# EasyEDA schematic KegWasher_12V_Abort_Filter_1.1_Schematic.EasyEDA.json
TITLE: Keg Washer 12V Abort Filter; REV: 1.1; Date: 2020-05-13; Sheet: 1/1; Drawn By: Kyle Hultman; Company: Kyle Hultman
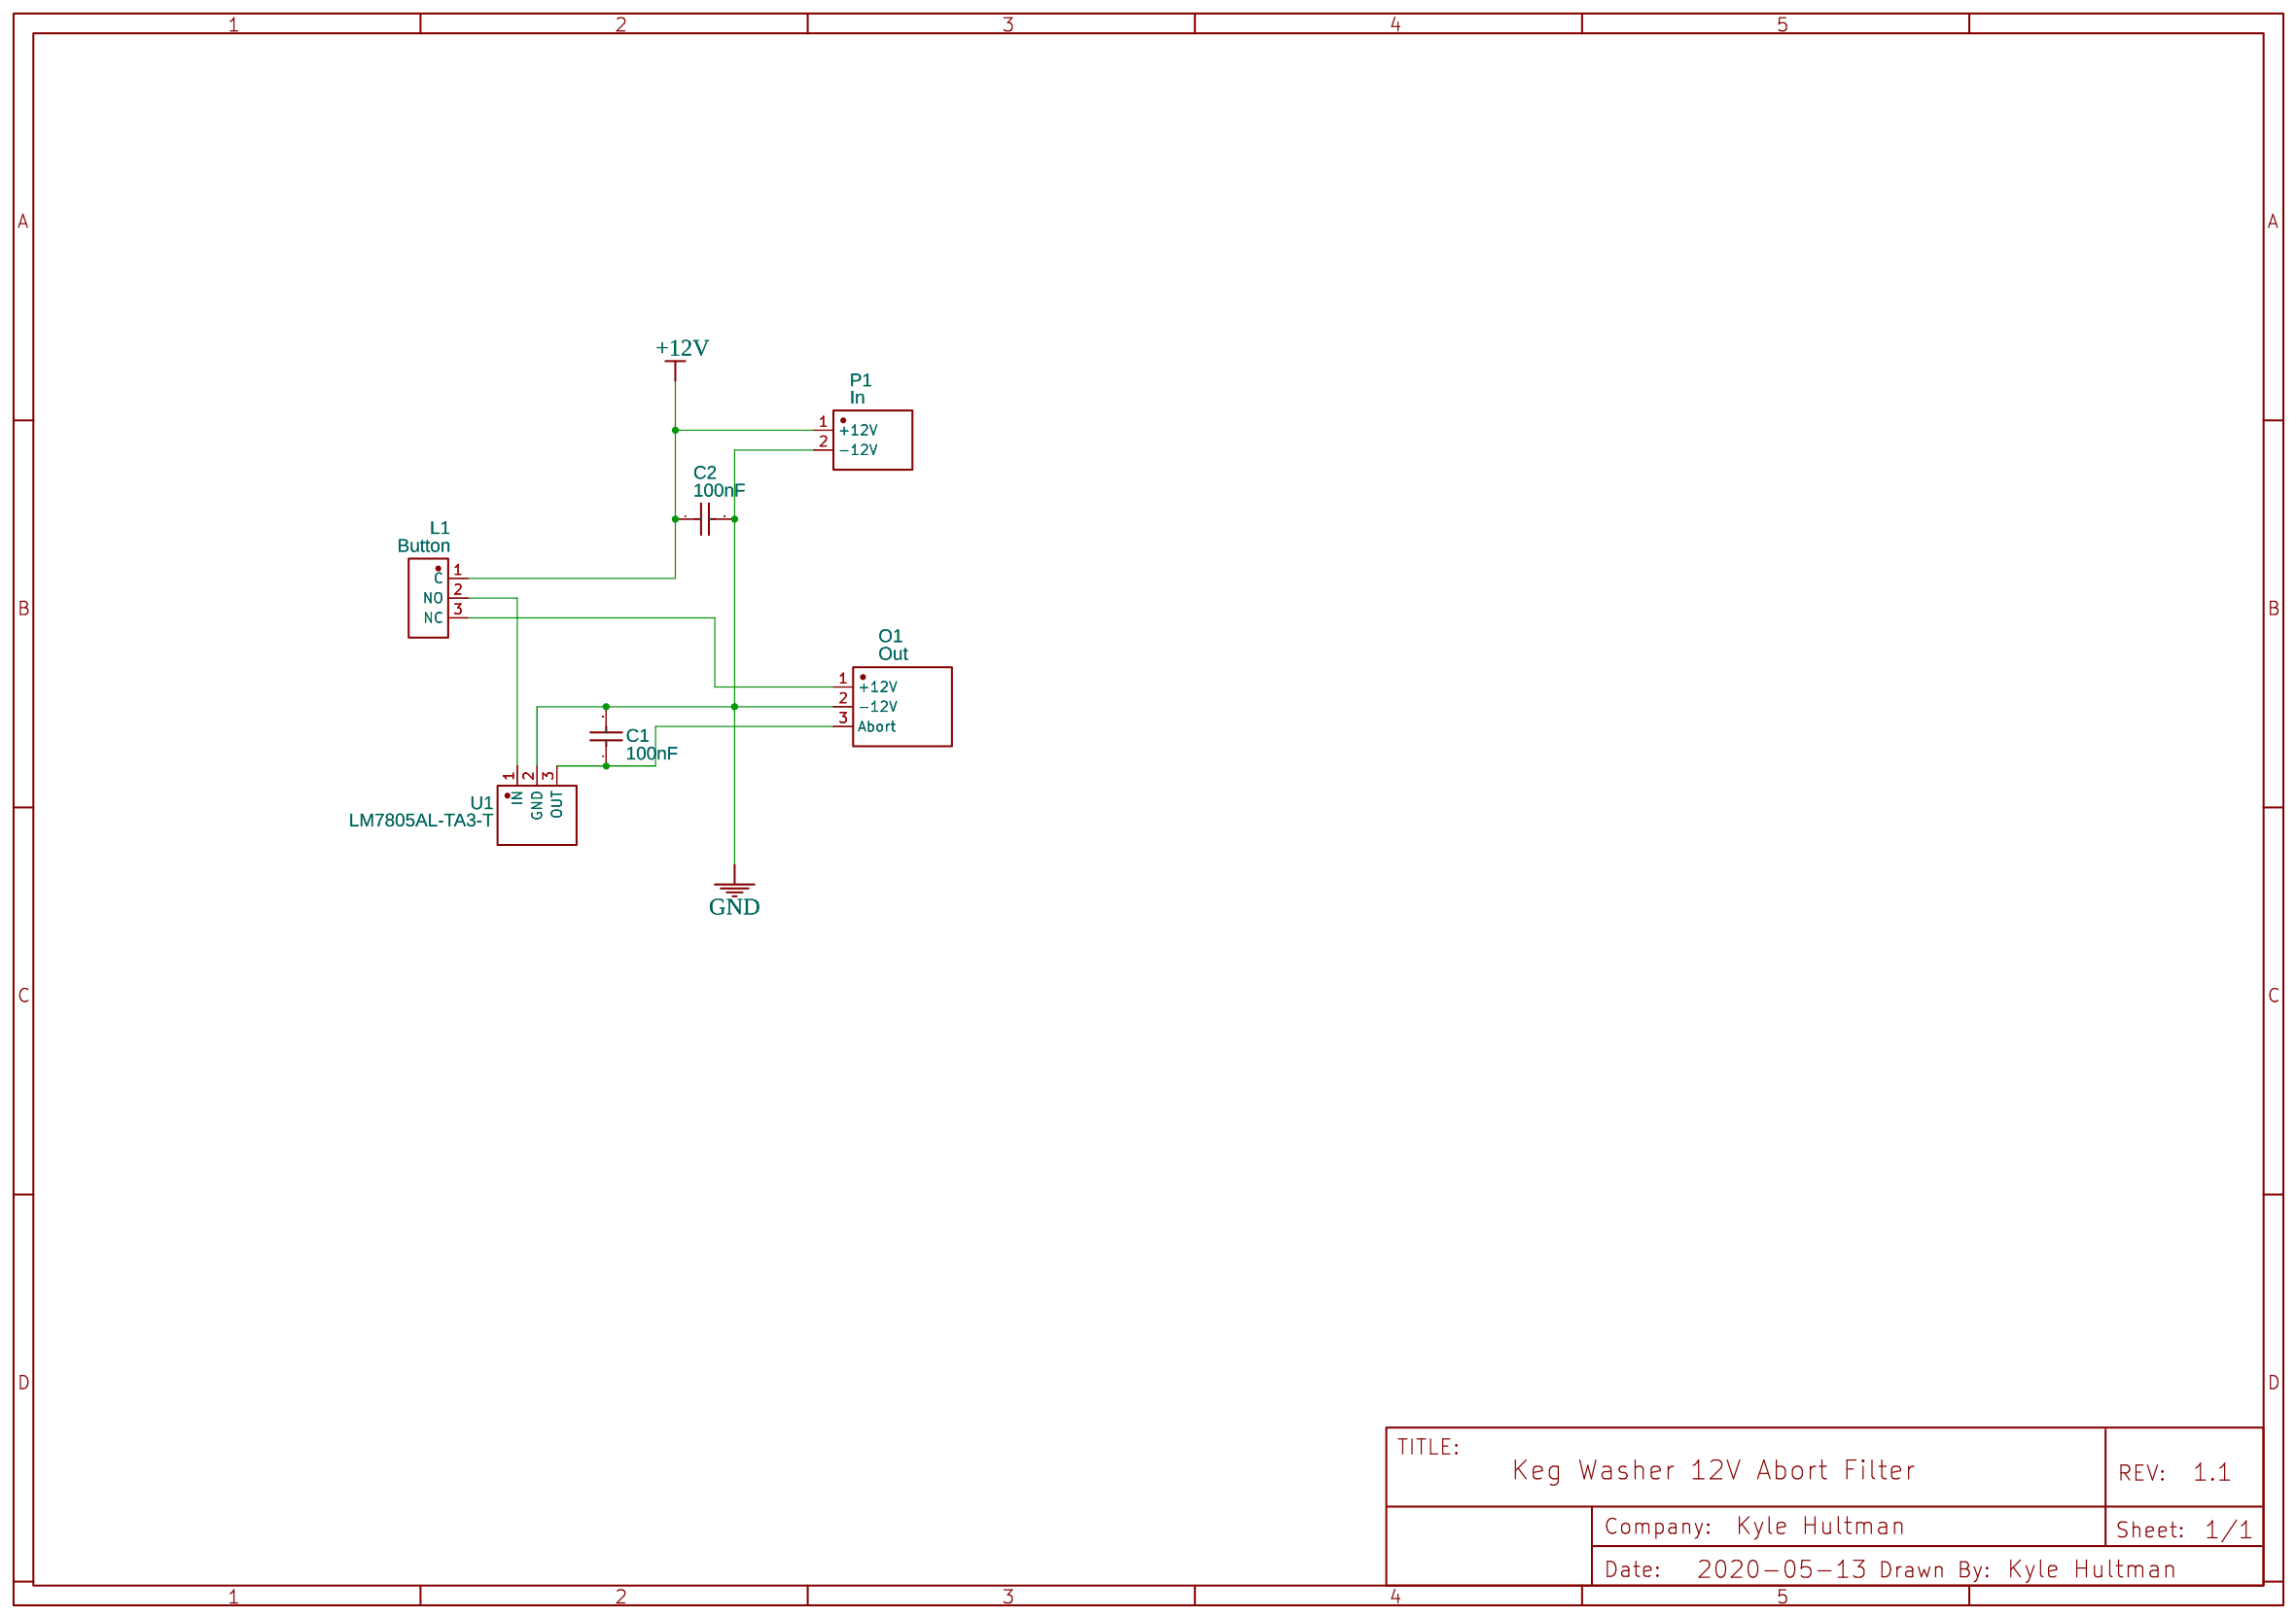
[diagram p0: schematic sheet]

## Parts
C1  100nF  [RAD-0.2]
C2  100nF  [RAD-0.2]
L1  Button  [HDR-M-2.54_1X3]
O1  Out  [HDR-M-2.54_1X3]
P1  In  [HDR-M-2.54_1X2]
U1  LM7805AL-TA3-T  [TO-220-3_L10.0-W4.5-P2.54-L]

## Library data of the parts
C1 C2 = 100nF: Supplier: LCSC; Manufacturer: LCSC; Manufacturer Part: 0.1UF(104) +-20% 63v; Supplier Part: C19355
L1 = Button
O1 = Out
P1 = In
U1 = LM7805AL-TA3-T: Supplier: LCSC; Supplier Part: C427632; Manufacturer: Unisonic Tech; Contributor: LCSC

## Nets
+12V: C2.1 L1.1(C) P1.1(+12V)
GND: C1.2 C2.2 O1.2(-12V) P1.2(-12V) U1.2(GND)
Net-(C1-1): C1.1 O1.3(Abort) U1.3(OUT)
Net-(L1-2): L1.2(NO) U1.1(IN)
Net-(L1-3): L1.3(NC) O1.1(+12V)
